# Altium schematic sheet 10D_MotorTest.SchDoc
size A4
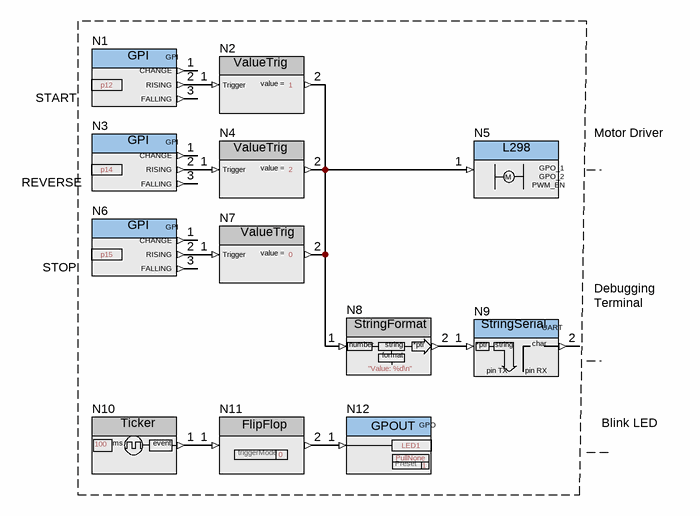
[diagram p0: 10D_MotorTest.SchDoc]

## Parts
N1  GPI  nBlocksParameter1: p12
N2  ValueTrig  nBlocksParameter1: 1
N3  GPI  nBlocksParameter1: p14
N4  ValueTrig  nBlocksParameter1: 2
N5  L298
N6  GPI  nBlocksParameter1: p15
N7  ValueTrig  nBlocksParameter1: 0
N8  StringFormat  nBlocksParameter1: "Value: %d\n"
N9  StringSerial
N10  Ticker  nBlocksParameter1: 100
N11  FlipFlop  Parameter 1: triggerMode  nBlocksParameter1: 0
N12  GPOUT  nBlocksParameter1: LED1  Parameter 3: Preset  nBlocksParameter3: 1  nBlocksParameter2: PullNone

## Nets
NetN1_2: N1.2(RISING) N2.1(Trigger)
NetN2_2: N2.2(OUT) N4.2(OUT) N5.1(ValueIn) N7.2(OUT) N8.1(IN)
NetN3_2: N3.2(RISING) N4.1(Trigger)
NetN6_2: N6.2(RISING) N7.1(Trigger)
NetN8_2: N8.2(OUT) N9.1(TX)
NetN10_1: N10.1(OUT) N11.1(IN)
NetN11_2: N11.2 N12.1(IN)

Not connected (* = marked no-connect by the designer): N1 1(CHANGE) 3(FALLING); N3 1(CHANGE) 3(FALLING); N6 1(CHANGE) 3(FALLING); N9 2(RX)

## Notes on the sheet
- START
- REVERSE
- Motor Driver
- STOP
- Debugging
- (near N9) Terminal
- Blink LED
- (in symbol NODE-GPOUT) GPO
- (in symbol NODE-L298) M; GPO_1; GPO_2; PWM_EN
- (in symbol NODE-STRINGFORMAT) number; string; *ptr; format
- (in symbol NODE-STRINGSERIAL) UART; *ptr; string; char; pin TX; pin RX
- (in symbol NODE-TICKER) ms; event
- (in symbol NODE-ValueTrig) value =

## Library data of the parts
N1 N3 N6 = NODE-GPI: General Purpose Input, with Change, Rising, Falling Outputs; Parameter 1: pinIn; ComponentLink1Description: link; ComponentLink1URL: https://github.com/nBlocksStudioNodes/nblocks_gpi
N2 N4 N7 = NODE-ValueTrig: when triggered outputs a preset Integer Value; Parameter 1: OutValue; ComponentLink1Description: link; ComponentLink1URL: https://github.com/nBlocksStudioNodes/nblocks_ValueTrig
N5 = NODE-L298: INA219 26V, 12-bit, i2c output current/voltage/power monitor API; Parameter 2: IN2; Parameter 1: IN1; Parameter 3: EN; nBlocksParameter3: LED4; nBlocksParameter2: LED3; nBlocksParameter1: LED2; ComponentLink1Description: link; ComponentLink1URL: https://github.com/nBlocksStudioNodes/nblocks_l298
N8 = NODE-STRINGFORMAT: Parameter 1: formatString; ComponentLink1Description: link; ComponentLink1URL: https://github.com/nBlocksStudioNodes/nblocks_stringformat
N9 = NODE-STRINGSERIAL: This node implements a serial port, where characters received from the external world (RX pin) are sent one by one to the node's output, but the node's input expects a full string object as input (sent entirely within one frame to the TX pin). / DO NOT CONNECT integer data into this node, as it will definitely lead to incorrect behaviour, sending random bytes in unpredicted amount to the serial port. This can be harmful depending on your design.; nBlocksParameter2: USBRX; Parameter 2: pinRX; nBlocksParameter1: USBTX; Parameter 1: pinTX; ComponentLink1Description: link; ComponentLink1URL: https://github.com/nBlocksStudioNodes/nblocks_stringserial
N10 = NODE-TICKER: Creates a Periodical Event; ComponentLink1Description: link; ComponentLink1URL: https://github.com/nBlocksStudioNodes/nblocks_ticker
N11 = NODE-FLIPFLOP: [0] for (triggerMode_Positive) when the received value is > 0,        [1] for ( triggerMode_Zero), will toggle when received value = 0,  [2] for ( triggerMode_Both) it will toggle on any value; ComponentLink1Description: link; ComponentLink1URL: https://github.com/nBlocksStudioNodes/nblocks_flipflop
N12 = NODE-GPOUT: General Purpose Mcroprocessor Output, set modeString as: PullUp, PullDown, PullNone, OpenDrain; Parameter 1: pinOut; ComponentLink1Description: link; ComponentLink1URL: https://github.com/nBlocksStudioNodes/nblocks_gpout; Parameter 2: modeString